# Altium schematic sheet christmas_tree_second.SchDoc
size A4
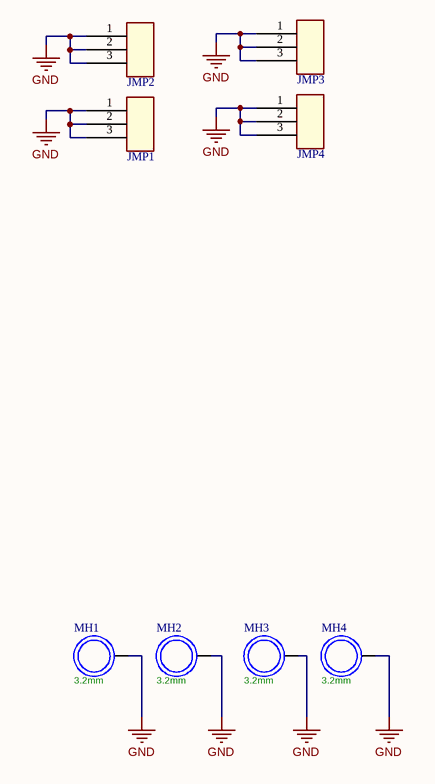
[diagram p0: christmas_tree_second.SchDoc]

## Parts
JMP1  JUMPER  [CON-HDR_3X1X254]  (value not drawn)
JMP2  JUMPER  [CON-HDR_3X1X254]  (value not drawn)
JMP3  JUMPER  [CON-HDR_3X1X254]  (value not drawn)
JMP4  JUMPER  [CON-HDR_3X1X254]  (value not drawn)
MH1  HOLE_DIAMETER: 3.2mm  [HOLE-3-2MM]  (hidden comment: MOUNT-PAD-ROUND_3.2)
MH2  HOLE_DIAMETER: 3.2mm  [HOLE-3-2MM]  (hidden comment: MOUNT-PAD-ROUND_3.2)
MH3  HOLE_DIAMETER: 3.2mm  [HOLE-3-2MM]  (hidden comment: MOUNT-PAD-ROUND_3.2)
MH4  HOLE_DIAMETER: 3.2mm  [HOLE-3-2MM]  (hidden comment: MOUNT-PAD-ROUND_3.2)

## Nets
GND: JMP1.1 JMP1.2 JMP1.3 JMP2.1 JMP2.2 JMP2.3 JMP3.1 JMP3.2 JMP3.3 JMP4.1 JMP4.2 JMP4.3 MH1.1 MH2.1 MH3.1 MH4.1

## Notes on the sheet
- Name
- Code
- Page Name
- Drawn by
- Checked by
- Class
- Stage
- Date
- Status
- Reference No.
- Revision
- Page size
- ©
- Page No.
- Copyright
- www.firmwave.com
- Variant
- Firmwave
- ®
- of

## Library data of the parts
JMP1-JMP4 = CON-HDR_3X1X254: PARTTYPE: CON-HDR_3X1X254
MH1-MH4 = MISC-MH_3.2: MOUNT-PAD-ROUND3.2; APPROVED: NO; PARTTYPE: MH_UNIVERSAL; CHECKED BY: *